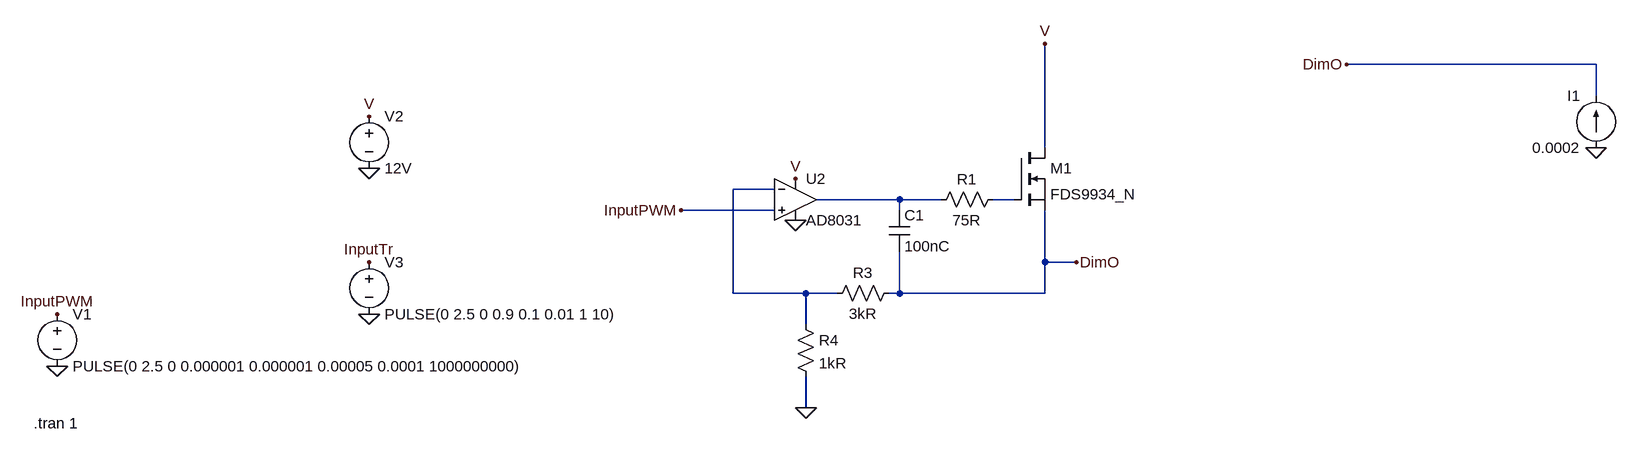
[diagram p0: schematic Amplific_Dimming.asc]
Amplific_Dimming.asc, the LTspice schematic file:
Version 4
SHEET 1 1860 680
WIRE 1824 -64 1440 -64
WIRE 1824 -16 1824 -64
WIRE 976 64 976 -96
WIRE 560 128 496 128
WIRE 752 144 624 144
WIRE 816 144 752 144
WIRE 928 144 896 144
WIRE 560 160 416 160
WIRE 752 160 752 144
WIRE 976 240 976 160
WIRE 1024 240 976 240
WIRE 496 288 496 128
WIRE 608 288 496 288
WIRE 656 288 608 288
WIRE 752 288 752 224
WIRE 752 288 736 288
WIRE 976 288 976 240
WIRE 976 288 752 288
WIRE 608 336 608 288
WIRE 608 464 608 416
FLAG 592 176 0
FLAG -64 16 V
FLAG -64 96 0
FLAG -64 240 InputTr
FLAG -64 320 0
FLAG 592 112 V
FLAG 1824 64 0
FLAG 608 464 0
FLAG 976 -96 V
FLAG 1024 240 DimO
FLAG 1440 -64 DimO
FLAG -544 320 InputPWM
FLAG -544 400 0
FLAG 416 160 InputPWM
SYMBOL voltage -64 0 R0
WINDOW 123 0 0 Left 0
WINDOW 39 0 0 Left 0
SYMATTR InstName V2
SYMATTR Value 12V
SYMBOL voltage -64 224 R0
WINDOW 123 0 0 Left 0
WINDOW 39 0 0 Left 0
SYMATTR InstName V3
SYMATTR Value PULSE(0 2.5 0 0.9 0.1 0.01 1 10)
SYMBOL nmos 928 64 R0
SYMATTR InstName M1
SYMATTR Value FDS9934_N
SYMBOL OpAmps\\AD8031 592 80 R0
SYMATTR InstName U2
SYMBOL res 912 128 R90
WINDOW 0 0 56 VBottom 2
WINDOW 3 32 56 VTop 2
SYMATTR InstName R1
SYMATTR Value 75R
SYMBOL current 1824 64 R180
WINDOW 0 24 80 Left 2
WINDOW 3 24 0 Left 2
WINDOW 123 0 0 Left 0
WINDOW 39 0 0 Left 0
SYMATTR InstName I1
SYMATTR Value 0.0002
SYMBOL res 752 272 R90
WINDOW 0 0 56 VBottom 2
WINDOW 3 32 56 VTop 2
SYMATTR InstName R3
SYMATTR Value 3kR
SYMBOL res 592 320 R0
SYMATTR InstName R4
SYMATTR Value 1kR
SYMBOL cap 736 160 R0
SYMATTR InstName C1
SYMATTR Value 100nC
SYMBOL voltage -544 304 R0
WINDOW 123 0 0 Left 0
WINDOW 39 0 0 Left 0
SYMATTR InstName V1
SYMATTR Value PULSE(0 2.5 0 0.000001 0.000001 0.00005 0.0001 1000000000)
TEXT -580 488 Left 2 !.tran 1

The netlist it stands for:
* Amplific_Dimming.asc
V2 V 0 12V
V3 InputTr 0 PULSE(0 2.5 0 0.9 0.1 0.01 1 10)
M1 V N003 DimO DimO FDS9934_N
XU2 InputPWM N001 V 0 N002 AD8031  ; pins In+ In- V+ V- OUT
R1 N003 N002 75R
I1 0 DimO 0.0002
R3 DimO N001 3kR
R4 N001 0 1kR
C1 N002 DimO 100nC
V1 InputPWM 0 PULSE(0 2.5 0 0.000001 0.000001 0.00005 0.0001 1000000000)
.model NMOS NMOS
.model PMOS PMOS
.lib standard.mos
.tran 1
.backanno
.end